# Altium schematic sheet Sheet1.SchDoc
size A0; SheetNumber: 1; SheetTotal: 2; SPICEModelCacheIBWEWSKS: <root> / <DocumentId>IBWEWSKS</DocumentId> / <CacheFrame Number="0"> / <Model Name="5848_744774033_3.3u" Kind="CKT"> / <Text>******* / .subckt 5848_744774033_3.3u 1 2 / Rp 1 2 12000 / Cp 1 2 3.4p / Rs 1 N3 0.042 / L1 N3 2 3.3u / .ends 5848_744774033_3.3u</Text> / </Model> / <Model Name="1054_744776127_27u" Kind="CKT"> / <Text>******* / .subckt 1054_744776127_27u 1 2 / Rp 1 2 22000 / Cp 1 2 4.7p / Rs 1 N3 0.0627 / L1 N3 2 27u / .ends 1054_744776127_27u</Text> / </Model> / </CacheFrame> / </root>
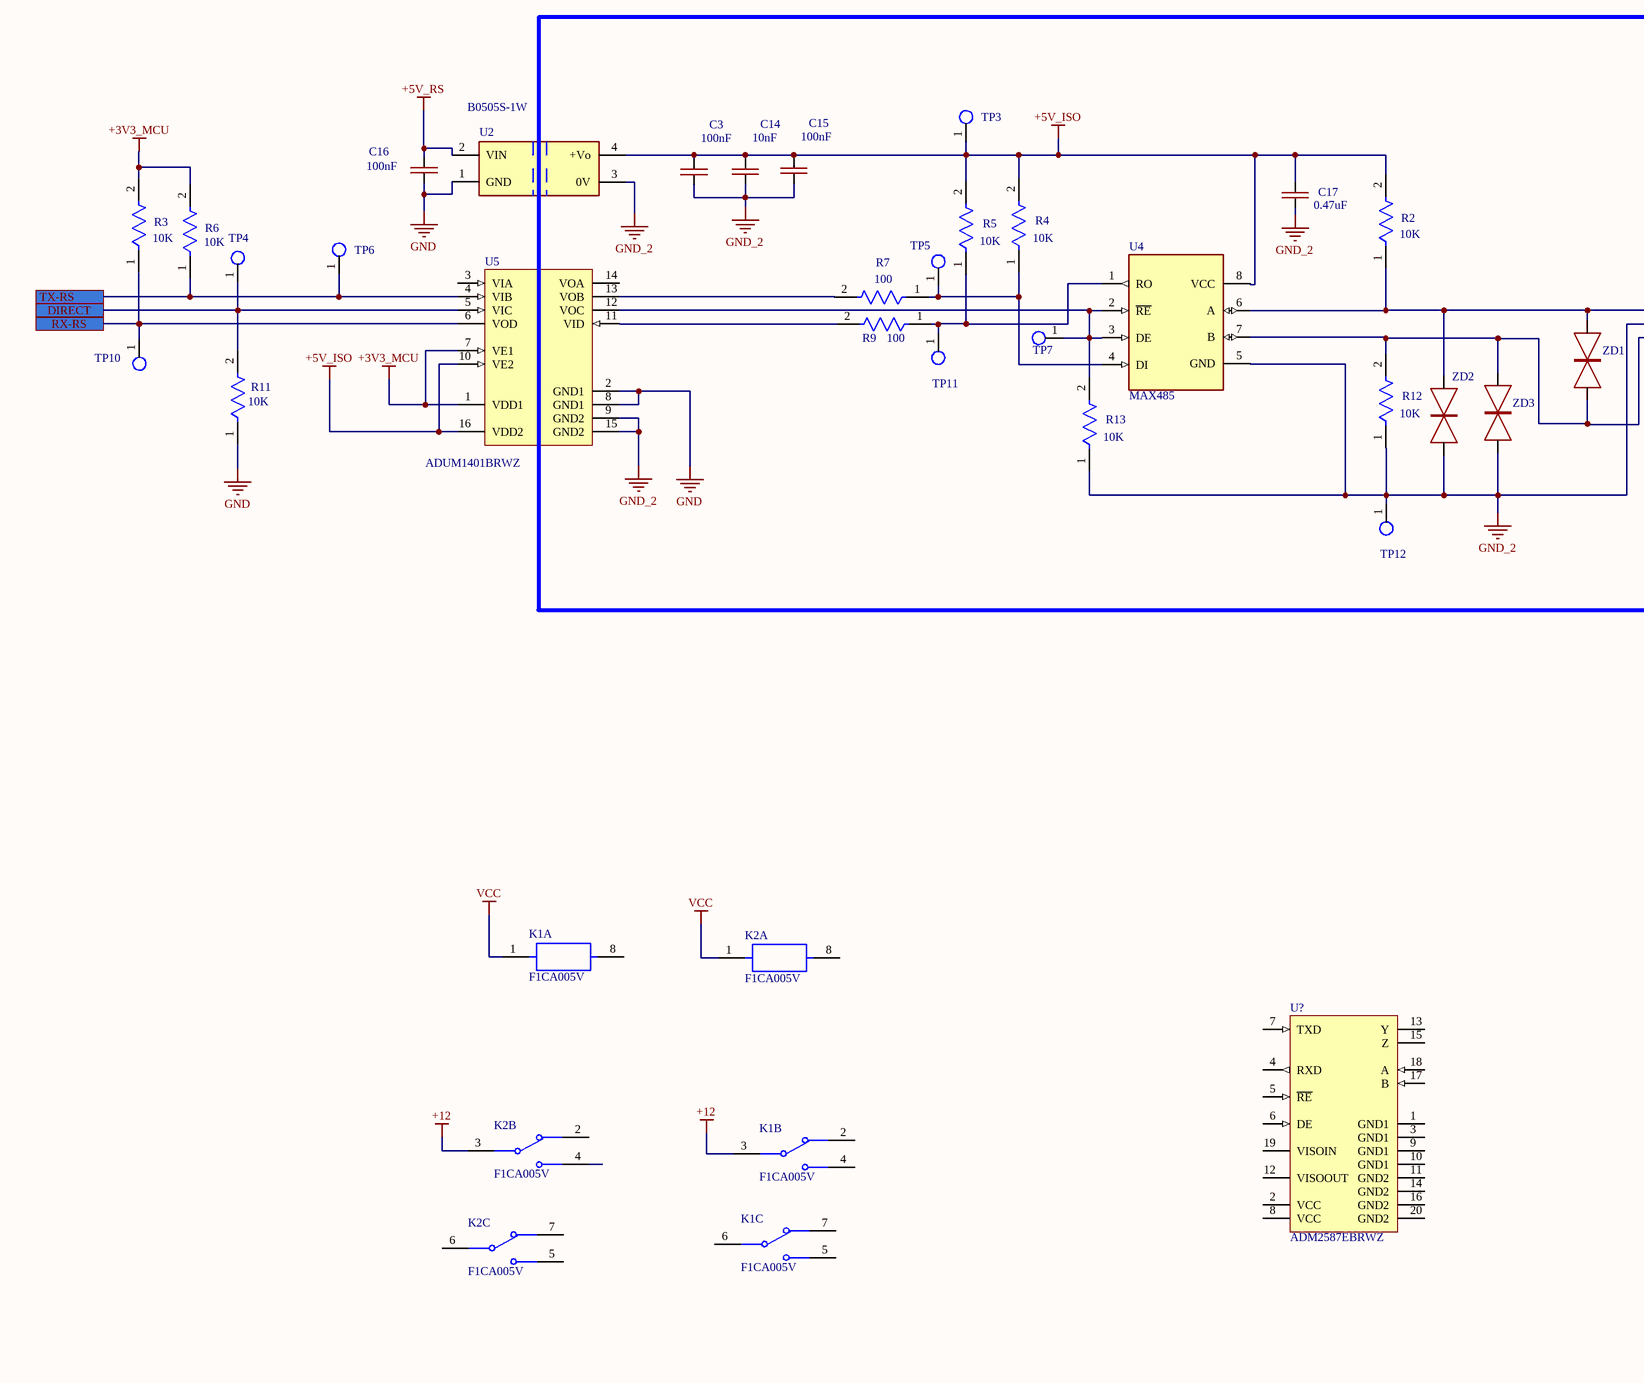
[diagram p0: Sheet1.SchDoc, left]
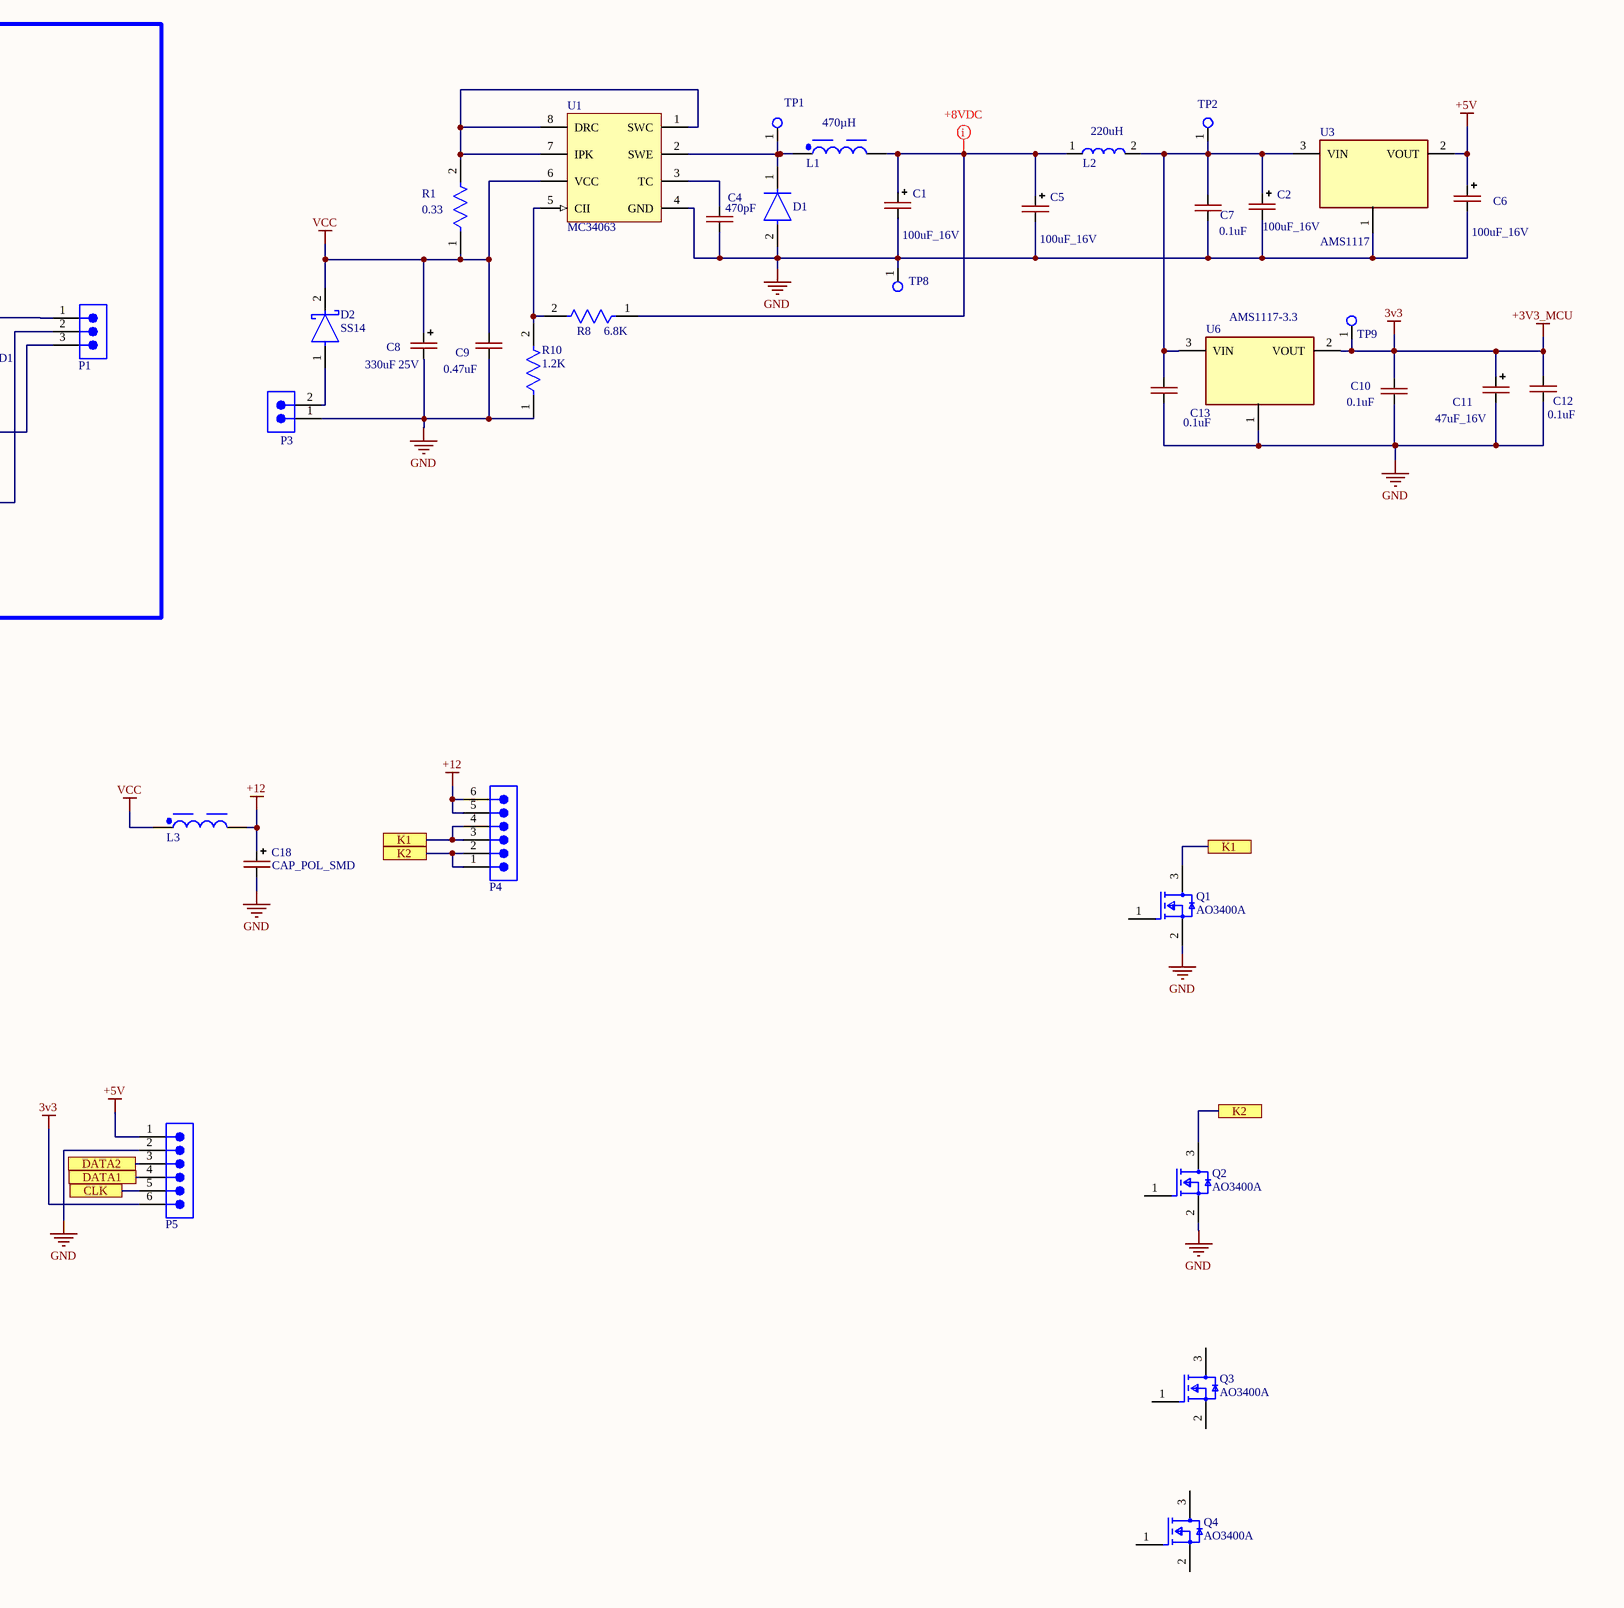
[diagram p1: Sheet1.SchDoc, right]

## Parts
C1  100uF_16V  [CAP-TAN-D]
C2  100uF_16V  [CAP-TAN-D]
C3  100nF  [CAP-0603]
C4  470pF  [CAP-0603]
C5  100uF_16V  [CAP-TAN-D]
C6  100uF_16V  [CAP-TAN-D]
C7  0.1uF  [CAP-0603]
C8  330uF 25V  [CAP_SMD_Size_E]
C9  0.47uF  [CAP-0805]
C10  0.1uF  [CAP-0603]
C11  47uF_16V  [CAP-TAN-D]
C12  0.1uF  [CAP-0603]
C13  0.1uF  [CAP-0603]
C14  10nF  [CAP-0603]
C15  100nF  [CAP-0603]
C16  100nF  [CAP-0603]
C17  0.47uF  [CAP-0805]
C18  CAP_POL_SMD  [CAP_SMD_SIZE_H]
D1  ES1G  [FP-403AE-MFG]  (value not drawn)
D2  SS14  [DO-214-AC]
K1  F1CA005V  [V23079-A1001-B301]  (parts A,B,C of 3)
K2  F1CA005V  [V23079-A1001-B301]  (parts A,B,C of 3)
L1  470µH  [WE-PD2_5848]
L2  220uH  [Coil_4.5x4.5_mm]
L3  27µH, 1.95A  [WE-PD2_1054]  (value not drawn)
P1  691305340003  [691305340003]  (value not drawn)
P3  691305140002  [691305140002]  (value not drawn)
P4  61300611121  [61300611121]  (value not drawn)
P5  61300611121  [61300611121]  (value not drawn)
Q1  AO3400A  [FP-SOT23-MFG]
Q2  AO3400A  [FP-SOT23-MFG]
Q3  AO3400A  [FP-SOT23-MFG]
Q4  AO3400A  [FP-SOT23-MFG]
R1  0.33  [RES-1206]
R2  10K  [RES-0603]
R3  10K  [RES-0603]
R4  10K  [RES-0603]
R5  10K  [RES-0603]
R6  10K  [RES-0603]
R7  100  [RES-0603]
R8  6.8K  [RES-0805]
R9  100  [RES-0603]
R10  1.2K  [RES-0805]
R11  10K  [RES-0603]
R12  10K  [RES-0603]
R13  10K  [RES-0603]
TP1  Test_Point_PCB  [Test_Point]  (value not drawn)
TP2  Test_Point_PCB  [Test_Point]  (value not drawn)
TP3  Test_Point_PCB  [Test_Point]  (value not drawn)
TP4  Test_Point_PCB  [Test_Point]  (value not drawn)
TP5  Test_Point_PCB  [Test_Point]  (value not drawn)
TP6  Test_Point_PCB  [Test_Point]  (value not drawn)
TP7  Test_Point_PCB  [Test_Point]  (value not drawn)
TP8  Test_Point_PCB  [Pin_Test_Point(Orange)]  (value not drawn)
TP9  Test_Point_PCB  [Test_Point]  (value not drawn)
TP10  Test_Point_PCB  [Test_Point]  (value not drawn)
TP11  (no value)  [Test_Point]
TP12  Test_Point_PCB  [Test_Point]  (value not drawn)
U1  MC34063  [SOIC-8_M]
U2  B0505S-1W  [B0505S-1W]
U3  AMS1117  [SOT-89]
U4  MAX485  [SOIC-8-MFG]
U5  ADUM1401BRWZ  [ADI-RW-16_M]
U6  AMS1117-3.3  [SOT-89]
U?  ADM2587EBRWZ  [ADI-RW-20_L]
ZD1  P6SMB16CA  [DO-214AA]  (value not drawn)
ZD2  P6SMB16CA  [DO-214AA]  (value not drawn)
ZD3  P6SMB16CA  [DO-214AA]  (value not drawn)

## Ports
CLK, DATA1, DATA2, DIRECT, K1 (see Sheet1[6A]), K1 (see Sheet1[8A]), K2 (see Sheet1[6A]), K2 (see Sheet1[8B]), RX-RS, TX-RS

## Nets
+3V3_MCU: C10.2 C11.1(+) C12.2 P5.6 R3.2 R6.2 TP9.1(G9) U5.1(VDD1) U5.7(VE1) U6.2(VOUT)  [also labelled 3v3]
+5V: C6.1(+) P5.1 U3.2(VOUT)
+5V_ISO: C3.2 C14.2 C15.2 C17.1 R2.2 R4.2 R5.2 TP3.1(G9) U2.4(+Vo) U4.8(VCC) U5.10(VE2) U5.16(VDD2)
+5V_RS: C16.2 U2.2(VIN)
+12: C18.1(+) K1.3 K2.3 L3.2 P4.5 P4.6
GND: C1.2(-) C2.2(-) C4.2 C5.2(-) C6.2(-) C7.1 C8.2(-) C9.2 C10.1 C11.2(-) C12.1 C13.1 C16.1 C18.2(-) D1.2(A) P3.1 P5.2 Q1.2(S) Q2.2(S) R10.1 R11.1 TP8.1(G9) U1.4(GND) U2.1(GND) U3.1(Ground) U5.2(GND1) U5.8(GND1) U6.1(Ground)
GND_2: C3.1 C14.1 C15.1 C17.2 P1.2 R12.1 R13.1 TP12.1(G9) U2.3(0V) U4.5(GND) U5.9(GND2) U5.15(GND2) ZD2.1(A) ZD3.1(A)
VCC: C8.1(+) C9.1 D2.2(C) K1.1 K2.1 L3.1 R1.1 U1.6(VCC)
CLK: P5.5 ; port CLK
DATA1: P5.4 ; port DATA1
DATA2: P5.3 ; port DATA2
DIRECT: R11.2 TP4.1(G9) U5.5(VIC) ; port DIRECT
K1: P4.3 P4.4 Q1.3(D) ; port K1
K2: P4.1 P4.2 Q2.3(D) ; port K2
RX-RS: R3.1 TP10.1(G9) U5.6(VOD) ; port RX-RS
TX-RS: R6.1 TP6.1(G9) U5.4(VIB) ; port TX-RS
NetC1_1: C1.1(+) C5.1(+) L1.2 L2.1 R8.1
NetC2_1: C2.1(+) C7.2 C13.2 L2.2 TP2.1(G9) U3.3(VIN) U6.3(VIN)
NetC4_1: C4.1 U1.3(TC)
NetD1_1: D1.1(C) L1.1 TP1.1(G9) U1.2(SWE)
NetD2_1: D2.1(A) P3.2
NetP1_1: P1.1 R2.1 U4.6(A) ZD1.2(A) ZD2.2(A)
NetP1_3: P1.3 R12.2 U4.7(B) ZD1.1(A) ZD3.2(A)
NetR1_2: R1.2 U1.1(SWC) U1.7(IPK) U1.8(DRC)
NetR4_1: R4.1 R7.1 TP5.1(G9) U4.4(DI)
NetR5_1: R5.1 R9.1 TP11.1(G9) U4.1(RO)
NetR7_2: R7.2 U5.13(VOB)
NetR8_2: R8.2 R10.2 U1.5(CII)
NetR9_2: R9.2 U5.11(VID)
NetR13_2: R13.2 TP7.1(G9) U4.2(~{RE}) U4.3(DE) U5.12(VOC)

Not connected (* = marked no-connect by the designer): K1 2 4 5 6 7 8; K2 2 4 5 6 7 8; Q1 1(G); Q2 1(G); Q3 1(G) 2(S) 3(D); Q4 1(G) 2(S) 3(D); U5 3(VIA) 14(VOA); U? 1(GND1) 2(VCC) 3(GND1) 4(RXD) 5(~{RE}) 6(DE) 7(TXD) 8(VCC) 9(GND1) 10(GND1) 11(GND2) 12(VISOOUT) 13(Y) 14(GND2) 15(Z) 16(GND2) 17(B) 18(A) 19(VISOIN) 20(GND2)

## Layout directives
mark named +8VDC: (no net found under the mark)

## Library data of the parts
C1 C2 C5 C6 C8 = CAP_POL_SMD
C3 C4 C7 C9 C10 C12-C17 = CAP-NON-POLAR
C11 = CAP-POLAR
D1 = ES1G: Ultrafast
L1 = 744774033: WE-PD2 SMT Power Inductor, size 5848, 3.3µH, 4A, 0.06Ω; Manufacturer: Wurth Elektronik; Case/Size Code: 5848; DC Resistance: 0.042Ω; Saturation Current: 7.5A; Self Resonant Frequency: 43MHz; Manufacturer Part Number: 744774033; Category: Unshielded Power Inductors; Match Code: WE-PD2; ComponentLink1Description: Website Link; ComponentLink1URL: https://www.we-online.com/redexpert/article/744774033?ad; ComponentLink2Description: Datasheet Link; ComponentLink2URL: https://www.we-online.com/redexpert/spec/744774033?ad; Mount: Surface Mount; Operating Temperature Max: 125°C; Operating Temperature Min: -40°C; Packaging: Tape and Reel; Length: 5.8mm; Width: 5.2mm; Height: 4.5mm; DC Resistance Max: 0.06Ω; Inductance: 3.3µH; Rated Current: 4A
L2 = Coil
L3 = 744776127: WE-PD2 SMT Power Inductor, size 1054, 27µH, 1.95A, 0.11Ω; Manufacturer: Wurth Elektronik; Case/Size Code: 1054; DC Resistance: 0.063Ω; Saturation Current: 1.98A; Self Resonant Frequency: 15MHz; Manufacturer Part Number: 744776127; Category: Unshielded Power Inductors; Match Code: WE-PD2; ComponentLink1Description: Website Link; ComponentLink1URL: https://www.we-online.com/redexpert/article/744776127?ad; ComponentLink2Description: Datasheet Link; ComponentLink2URL: https://www.we-online.com/redexpert/spec/744776127?ad; Mount: Surface Mount; Operating Temperature Max: 125°C; Operating Temperature Min: -40°C; Packaging: Tape and Reel; Length: 10mm; Width: 9mm; Height: 5.4mm; DC Resistance Max: 0.11Ω; Inductance: 27µH; Rated Current: 1.95A
P1 = 691305340003: WR-TBL Series 3053 Horizontal PCB Header, THT, pitch 3.81mm, 3p; Manufacturer: Wurth Elektronik; Modularity: No; Rated Current: 12A; Working Voltage: 300V; ComponentLink1Description: Website Link; ComponentLink1URL: https://www.we-online.com/redexpert/article/691305340003?ad; ComponentLink2Description: Datasheet Link; ComponentLink2URL: https://www.we-online.com/redexpert/spec/691305340003?ad; Manufacturer Part Number: 691305340003; Category: Terminal Blocks; Match Code: WR-TBL; Mount: Through Hole; Operating Temperature Max: 105°C; Operating Temperature Min: -40°C; Packaging: Box; Application: Pluggable; Number of Pins: 3; Number of Rows: 1; Orientation: Horizontal; Pitch: 3.81mm
P3 = 691305140002: WR-TBL Series 3051 Horizontal PCB Header, THT, pitch 3.5mm, 02p; Manufacturer: Wurth Elektronik; Rated Current: 12A; Working Voltage: 300V; Modularity: No; System: Pluggable Connector; Manufacturer Part Number: 691305140002; Category: Terminal Block; ComponentLink1Description: Website Link; ComponentLink1URL: https://www.we-online.com; ComponentLink2Description: Datasheet Link; ComponentLink2URL: https://www.we-online.com/components/products/datasheet/691305140002; Mount: Through Hole; Operating Temperature Min: -40degC; Operating Temperature Max: 105degC; Packaging: Box; Application: Pluggable; Number of Pins: 2; Number of Rows: 1; Orientation: Horizontal; Lead Pitch: 3.5mm
P4 P5 = 61300611121: WR-PHD Pin Header, THT, Vertical, pitch 2.54mm, 1 Row, 6P; Manufacturer: Wurth Elektronik; Contact Resistance: 20mOhm; Rated Current: 3A; Working Voltage: 250V; Withstanding Voltage: 500V; Manufacturer Part Number: 61300611121; Category: Board-to-Board Connectors; Match Code: WR-PHD; ComponentLink1Description: Website Link; ComponentLink1URL: https://www.we-online.com/redexpert/article/61300611121?ad; ComponentLink2Description: Datasheet Link; ComponentLink2URL: https://www.we-online.com/redexpert/spec/61300611121?ad; Mount: Through Hole; Operating Temperature Max: 105°C; Operating Temperature Min: -40°C; Packaging: Bag; Gender: Pin Header; Number of Pins: 6; Number of Rows: 1; Orientation: Vertical; Pitch: 2.54mm
Q1-Q4 = CMP-83955-000006-1: MOSFET N-CH 30V 5.7A SOT23; Input Capacitance: 630pF; Number of Elements: 1; Rds On Max: 26.5mR; Max Power Dissipation: 1.4W; Gate to Source Voltage (Vgs): 12V; Min Operating Temperature: -55°C; Lead Free: Lead Free; Number of Pins: 3; Drain to Source Voltage (Vdss): 30V; Case/Package: SOT-23; Mount: Surface Mount; Continuous Drain Current (ID): 5.7A; Radiation Hardening: No; Packaging: Tape and Reel; Max Operating Temperature: 150°C; Power Dissipation: 1.4W
R1-R13 = RES-CONST
TP1-TP12 = TP_PCB?: Test_Point
U5 = CMP-0534-00565-1: Quad Channel Digital Isolator, 2.5 KV rms Insulation Rating, 10 Mbps Data Rate, 50 ns Delay, Industrial, 16-pin SOIC (RW-16), Tube; Manufacturer: Analog Devices; Max Data Rate: 10Mbps; ComponentLink2URL: http://www.analog.com/static/imported-files/data_sheets/ADuM1400_1401_1402.pdf; ComponentLink5Description: URL Link2; ComponentLink3URL: http://www.analog.com/static/imported-files/packages/PKG_PDF/SOIC_WIDE%20%28RW%29/RW_16.pdf; DatasheetVersion: Rev. H; ComponentLink2Description: Datasheet; ComponentLink3Description: Package Specification; PartNumber: ADUM1401BRWZ; ComponentLink5URL: Reference Circuit:http://www.analog.com/en/interface-isolation/digital-isolators/adum1401/products/product.html#product-recommendations; Max Operating Temp (degreesC): 125; PackageReference: RW-16; PackageVersion: 032707-B, 03/2007; ComponentLink1Description: Manufacturer URL; Code_JEDEC: MS-013-AA; PackageDescription: 16-Pin Standard Small Outline Package, Body 10.3 x 7.5 mm, Pitch 1.27 mm; Mounting Technology: Surface Mount; ComponentLink1URL: http://www.analog.com/en/index.html; ComponentLink4Description: URL Link1; ComponentLink4URL: Product URL:http://www.analog.com/en/interface-isolation/digital-isolators/adum1401/products/product.html
U6 = AMS1117
U? = CMP-2000-05759-1: Signal and Power Isolated RS-485 Transceiver with +/- 15 KV ESD Protection, 500 Kbps, -40 to 85 degC, 20-Pin SOIC (RW20), RoHS, Tube; Manufacturer: Analog Devices; Number of Transmitters: 1; Dual Supply Voltage (Max): NotRequiredV; DELETED: Compliant; Data Transmission Topology: Multidrop/Multipoint; Package Version: 060706-A, 06/2006; Single Supply Voltage (Max): 5.5V; Data Rate: 16kbps; Receiver Signal Type: Differential; Rad Hardened: No; Single Supply Voltage (Typ): 3.3/5V; Power Supply Requirement: Single; Single Supply Voltage (Min): 3V; Supply Current: 125mA; Operating Temp Range: -40Cto85C; Mounting: SurfaceMount; Datasheet Version: Rev. E, 10/2014; Manufacturer URL: http://www.analog.com/; Mounting Technology: SurfaceMount; Package Description: 20-Pin Standard Small Outline Package, Body 12.8 x 7.5 mm, Pitch 1.27 mm; Pin Count: 20; Dual Supply Voltage (Typ): NotRequiredV; Package Type: SOICW; Package URL: http://www.analog.com/static/imported-files/packages/233848RW_20.pdf; Packaging: Rail/Tube; Transmitter Signal Type: Differential; Number of Receivers: 1; Number of Transceivers: 1; Package Reference: RW-20; Operating Temperature Classification: Industrial; Dual Supply Voltage (Min): NotRequiredV; Datasheet URL: http://www.analog.com/media/en/technical-documentation/data-sheets/ADM2582E_2587E.pdf